# EAGLE design Timbre (EAGLE 6.6.0)
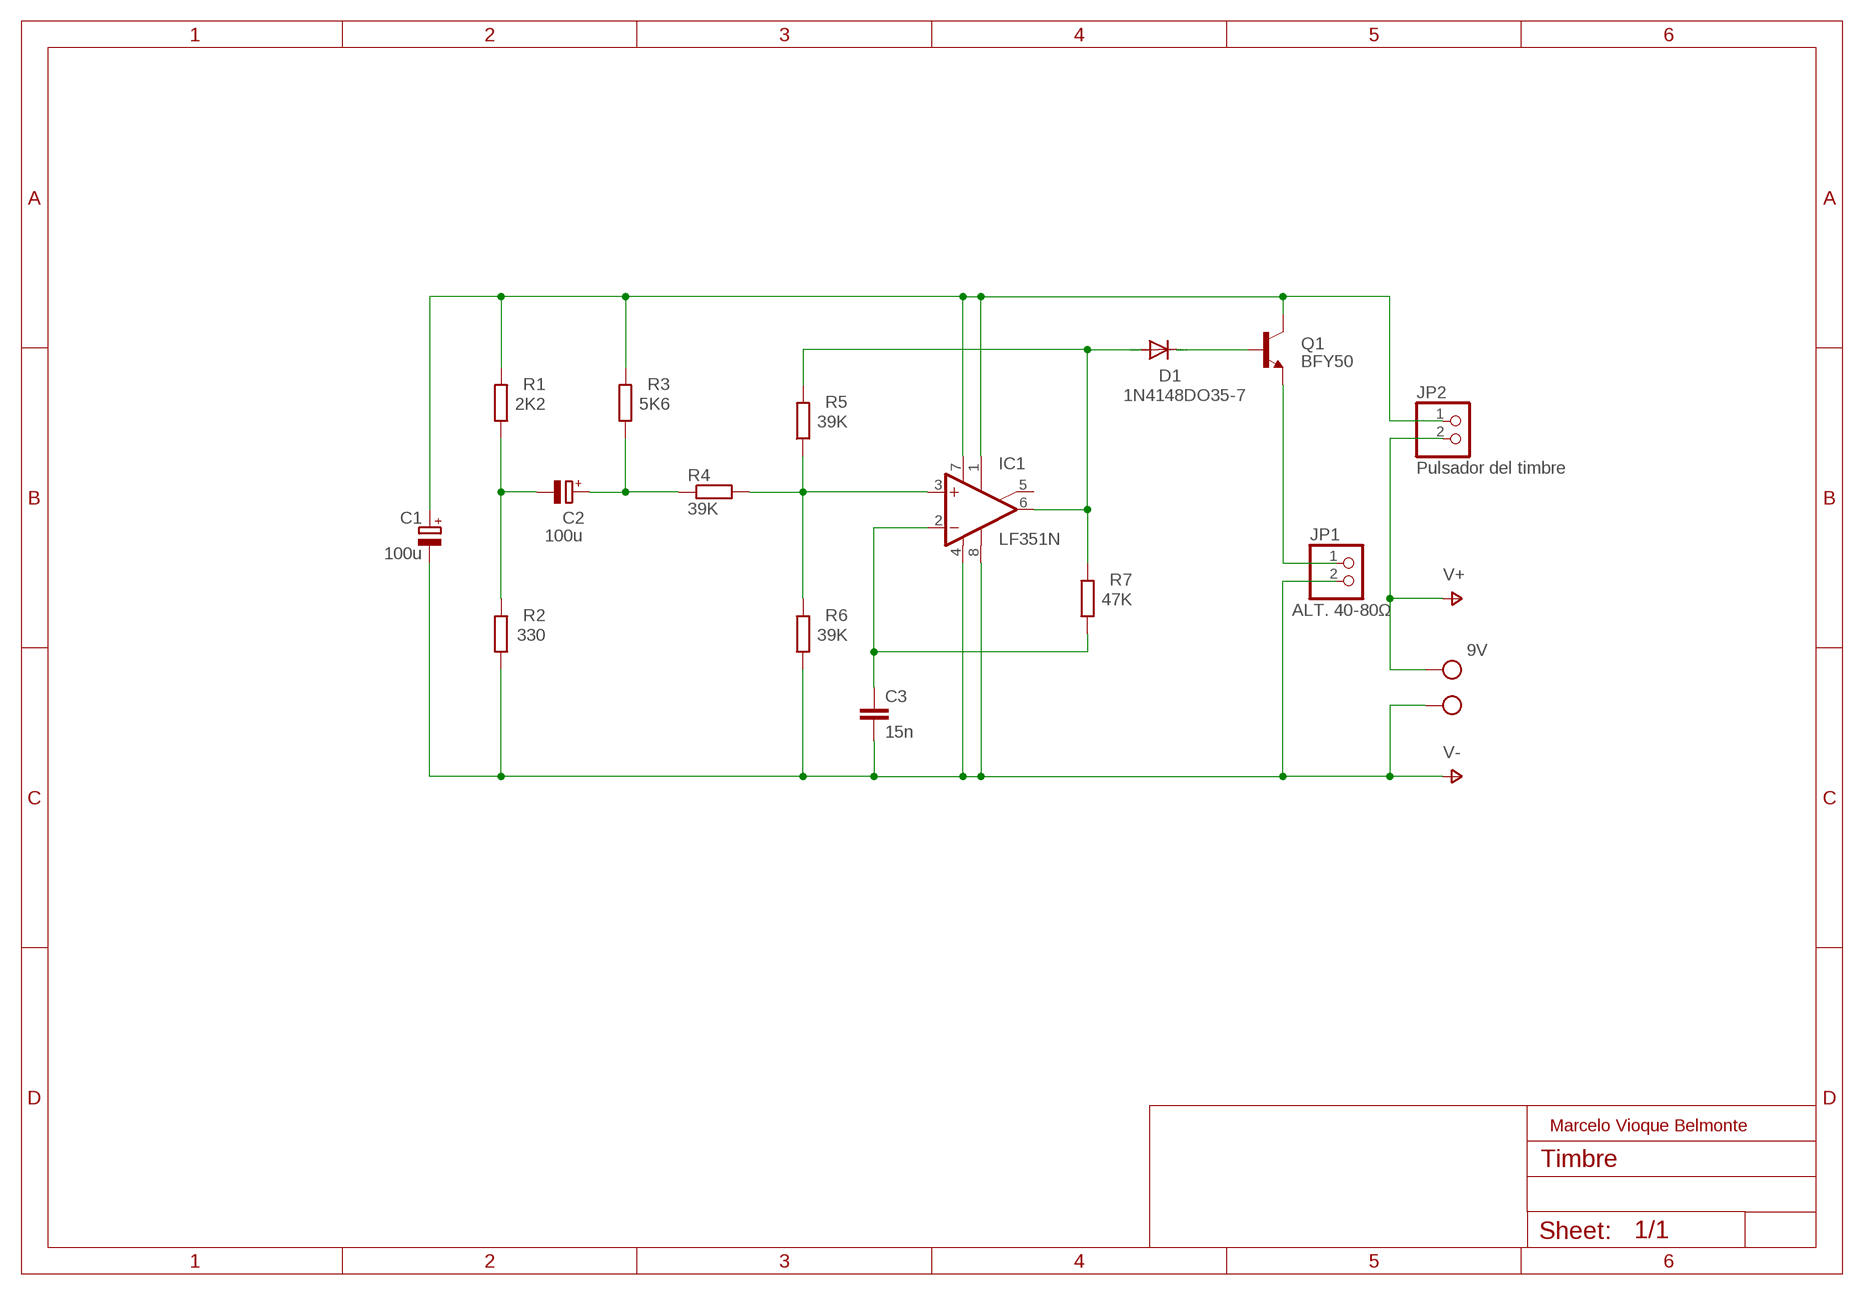
[diagram p0: schematic, sheet 1]

## Parts
C1  100u  CPOL-EUE2.5-6  [E2,5-6]
C2  100u  CPOL-EUE2.5-6  [E2,5-6]
C3  15n  C-EU025_050-025X075  [C025_050-025X075]
D1  1N4148DO35-7  [DO35-7]
IC1  LF351N  [DIL08]
JP1  ALT. 40-80Ω  PINHD-1X2  [1X02]
JP2  Pulsador del timbre  PINHD-1X2  [1X02]
Q1  BFY50  [TO39]
R1  2K2  R-EU_0207/10  [0207/10]
R2  330  R-EU_0207/10  [0207/10]
R3  5K6  R-EU_0207/10  [0207/10]
R4  39K  R-EU_0207/10  [0207/10]
R5  39K  R-EU_0207/10  [0207/10]
R6  39K  R-EU_0207/10  [0207/10]
R7  47K  R-EU_0207/10  [0207/10]
X1  9V  AK500/2  [AK500/2]

## Nets
N$1: IC1.3(+IN) R4.2 R5.1 R6.2
N$2: D1.A IC1.6(OUT) R5.2 R7.2
N$3: C3.1 IC1.2(-IN) R7.1
N$4: D1.C Q1.2(B)
N$5: C2.+ R3.1 R4.1
N$6: C1.+ IC1.1(ON1) IC1.7(V+) JP2.1 Q1.3(C) R1.2 R3.2
N$8: C2.- R1.1 R2.2
N$9: JP1.1 Q1.1(E)
V+: JP2.2 X1.2
V- [V-]: C1.- C3.2 IC1.4(V-) IC1.8(OPT) JP1.2 R2.1 R6.1 X1.1
Unconnected: IC1.5(ON2)

## Notes on the sheet
- Marcelo Vioque Belmonte

## Library data of the parts
C1 C2 = rcl:CPOL-EU: POLARIZED CAPACITOR, European symbol
C3 = rcl:C-EU: CAPACITOR, European symbol
D1 = diode:1N4148: DIODE high speed (Philips)
IC1 = linear:LF351: OP AMP
JP1 JP2 = pinhead:PINHD-1X2: PIN HEADER
Q1 = transistor-npn:BFY50*: NPN Transistor
R1-R7 = resistor:R-EU_: RESISTOR, European symbol
X1 = con-ptr500:AK500/2: CONNECTOR; OC_FARNELL: unknown; OC_NEWARK: unknown

## Net classes
0 default: width 1.2 mm
1 V-: width 1.4 mm

## Board
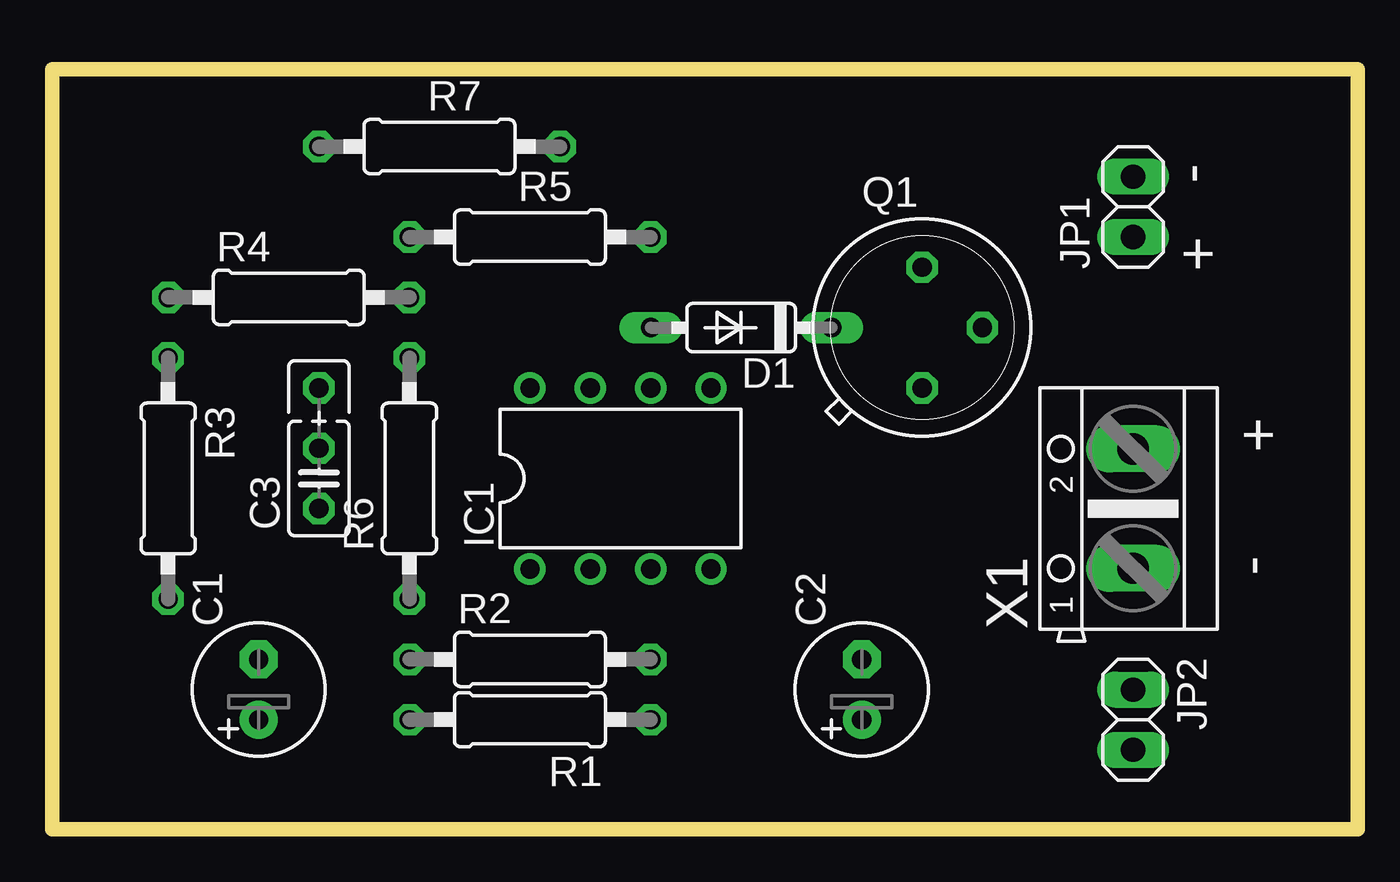
[diagram p1: board, top side]
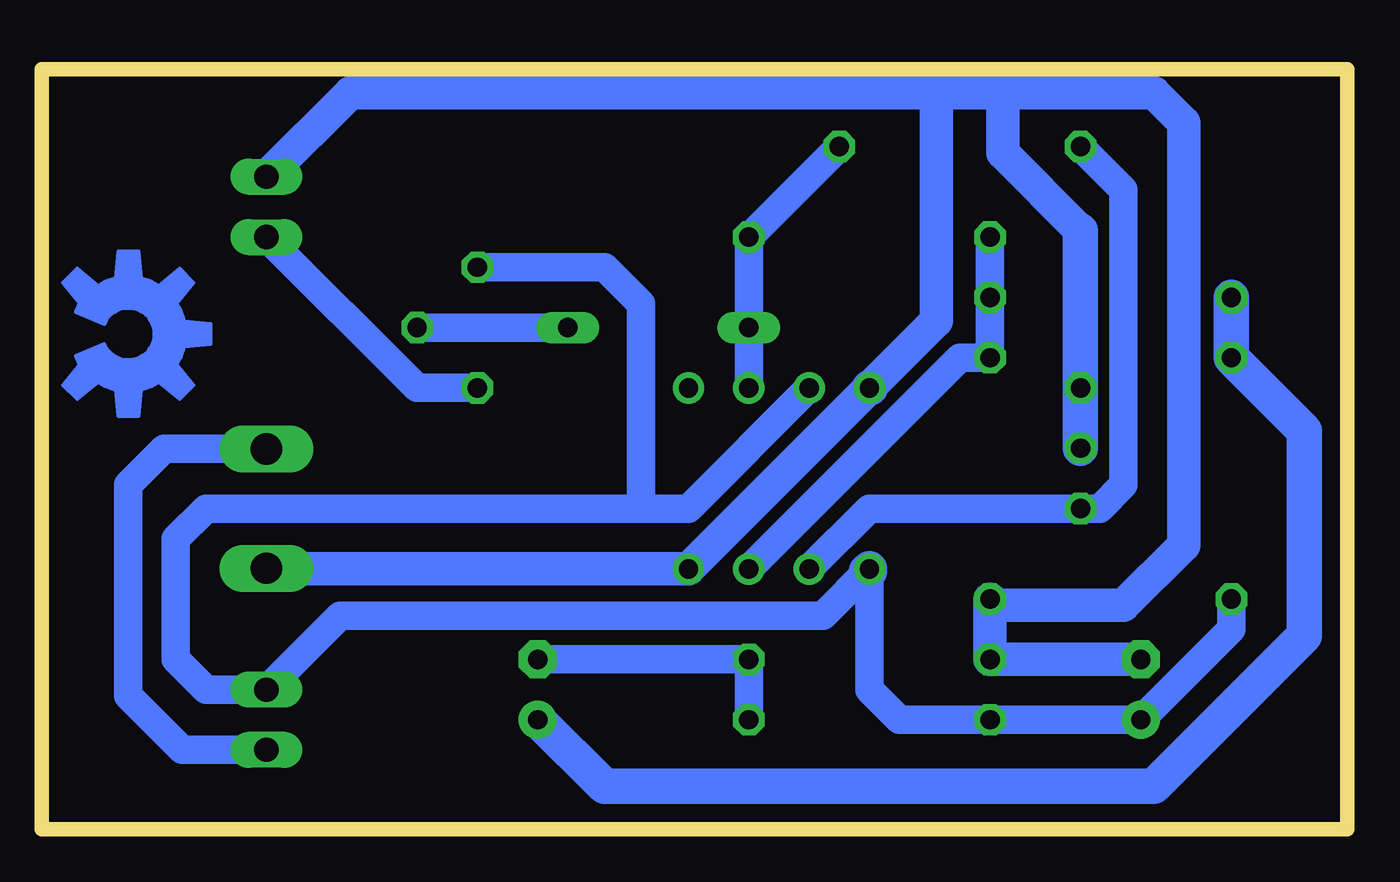
[diagram p2: board, bottom side, seen from below]

No outline drawn. Coordinates in mm, seen from the top.
Copper layers (1*16): Top 0.035mm / dielectric 1.5mm / Bottom 0.035mm
Design rules "default *": minimum track width 10mil, minimum drill 24mil, track to track 8mil, track to pad 8mil, pad to pad 8mil, via to via 8mil, smd to smd 8mil, copper to edge 40mil, drill to drill 8mil, minimum pad ring 10mil, minimum via ring 8mil, stop-mask expansion 4mil, vias tented up to drill 0mil, thermal gap 10mil
Milling: 4 lines

### Footprints (pad centres in the part's own frame; a part is rotated, then mirrored left to right if it is on the bottom)
E2,5-6 = drill 0.813 pad 1.6: + -1.27,0 | drill 0.813 pad 1.6 octagon: - 1.27,0
C025_050-025X075 = drill 0.813 octagon: 1 -1.27,0; 2 1.27,0; 3 3.81,0
DO35-7 = drill 0.813 long: A 3.81,0; C -3.81,0
DIL08 = drill 0.813 pad 1.27: 1 -3.81,-3.81; 2 -1.27,-3.81; 3 1.27,-3.81; 4 3.81,-3.81; 5 3.81,3.81; 6 1.27,3.81; 7 -1.27,3.81; 8 -3.81,3.81
1X02 = drill 1.016 long: 1 -1.27,0; 2 1.27,0
TO39 = drill 0.813 octagon: 1 0,-2.54; 2 2.54,0; 3 0,2.54
0207/10 = drill 0.813 octagon: 1 -5.08,0; 2 5.08,0
AK500/2 = drill 1.321 long: 1 -2.515,0; 2 2.515,0

### Placement (x,y rotation side)
C1  10.7,7.89 90 top
C2  36.1,7.89 90 top
C3  13.24,16.78 90 top
D1  31.02,23.13 180 top
IC1  25.94,16.78 0 top
JP1  47.53,28.21 90 top
JP2  47.53,6.62 270 top
Q1  38.64,23.13 0 top
R1  22.13,6.62 180 top
R2  22.13,9.16 0 top
R3  6.89,16.78 270 top
R4  11.97,24.4 0 top
R5  22.13,26.94 0 top
R6  17.05,16.78 90 top
R7  18.32,30.75 0 top
U$1  [OSHW-LOGO-L]  53.34,22.86 90 top
X1  47.53,15.51 90 top

### Tracks (layer width: path | path; a pad name or v marks a point on that pad's centre or on a via)
N$1
  Bottom 1.2: R5.1 R4.2 R6.2 18.32,21.86 IC1.3
N$2
  Bottom 1.2: IC1.6 D1.A R5.2 R7.2
N$3
  Bottom 1.2: IC1.2 22.13,15.51 C3.1 12.43,15.51 11.43,16.51 11.43,28.94 R7.1
N$4
  Bottom 1.2: D1.C Q1.2
N$5
  Bottom 1.5: C2.+ 33.29,3.81 10.16,3.81 3.81,10.16 3.81,18.78 R3.1 R4.1
N$6
  Bottom 1.016: 24,11 24.1,11
  Bottom 1.2: Q1.3 33.29,25.67 31.75,24.13 31.75,15.51 | IC1.7 29.75,15.51 31.75,15.51 | 31.75,15.51 50.07,15.51 51.34,14.24 51.34,9.16 50.07,7.89 JP2.1 44.42,11 24.1,11 IC1.1 22.13,7.89 20.86,6.62 R1.2 C1.+ 6.89,10.43 R3.2
  Bottom 1.5: IC1.1 22.13,12.87 22.26,12.87
N$8
  Bottom 1.2: C2.- R2.2 R1.1
N$9
  Bottom 1.2: Q1.1 41.18,20.59 JP1.1
V+
  Bottom 1.2: X1.2 51.83,18.02 53.34,16.51 53.34,7.62 51.07,5.35 JP2.2
V-
  Bottom 1.4: 47.51,12.97 IC1.4 IC1.8 19.3,23.42 19.3,33.02 | 13.24,27.21 16.51,30.48 16.51,33.02 | 19.3,33.02 43.99,33.02 JP1.2 | 19.3,33.02 16.51,33.02 | 16.51,33.02 10.16,33.02 8.89,31.75 8.89,13.97 11.43,11.43 16.78,11.43 R6.1 R2.1 C1.-
  Bottom 1.5: 47.51,12.97 X1.1 | IC1.8 22.08,20.59 | C3.2 13.24,27.21

### Text on the board
tPlace: - | + | + | -